# Altium schematic sheet 6-CURRENT_CHECK.SchDoc: RD15002_SingleSCT.PrjPcb
size A4; DrawnBy: 邓勇杰; Revision: A1.0.0; SheetNumber: 7; SheetTotal: 10; Time: 2015/12/2
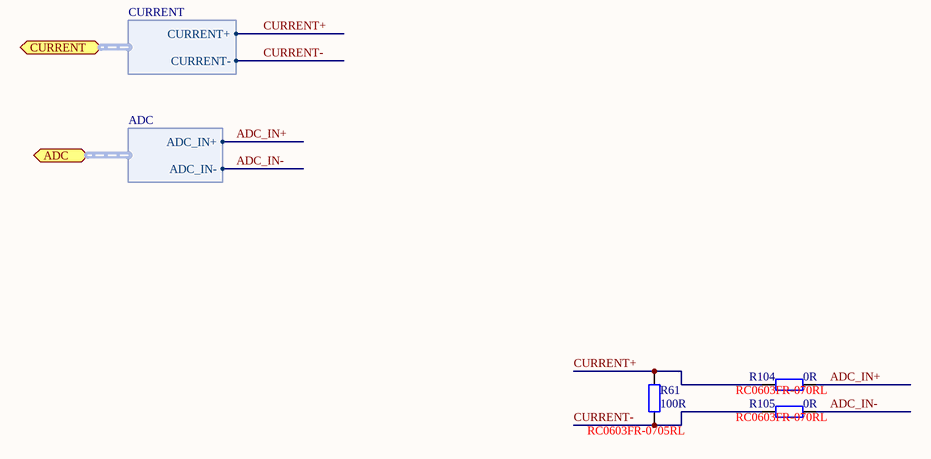
[diagram p0: 6-CURRENT_CHECK.SchDoc]

## Parts
R61  100R  Type No.: RC0603FR-0705RL  [CC0603]
R104  0R  Type No.: RC0603FR-070RL  [CC0603]
R105  0R  Type No.: RC0603FR-070RL  [CC0603]

## Ports
ADC (harness ADC), CURRENT (harness CURRENT)

## Harnesses
CURRENT: CURRENT+, CURRENT-
ADC: ADC_IN+, ADC_IN-

## Nets
ADC_IN+: R104.1 ; port ADC.ADC_IN+
ADC_IN-: R105.1 ; port ADC.ADC_IN-
CURRENT+: R61.1 R104.2 ; port CURRENT.CURRENT+
CURRENT-: R61.2 R105.2 ; port CURRENT.CURRENT-

## Notes on the sheet
- 文件版本:
- 原理图名:
- 工 程  名:
- 绘       制:
- 审       核:
- 第   页，共    页
- 日       期:

## Library data of the parts
R61 R104 R105 = Res2: Resistor